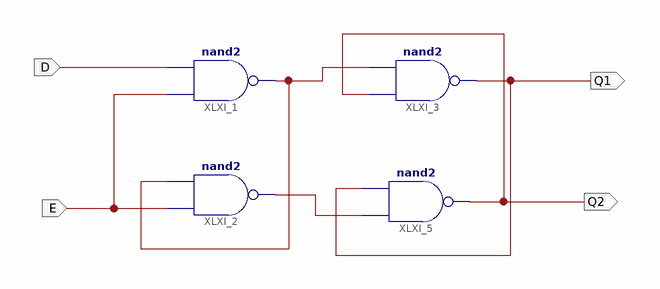
[diagram p0: schematic sheet 1]
// Xilinx ISE schematic klopD.sch (spartan3e) as structural Verilog: 4 symbols, 4 ports
module klopD (
  input  D,
  input  E,
  output Q1,
  output Q2
);

  wire XLXN_5, XLXN_7;

  nand XLXI_1 (XLXN_5, E, D);
  nand XLXI_2 (XLXN_7, E, XLXN_5);
  nand XLXI_3 (Q1, Q2, XLXN_5);
  nand XLXI_5 (Q2, XLXN_7, Q1);
endmodule
